# Altium schematic sheet Transformer.SchDoc
size A
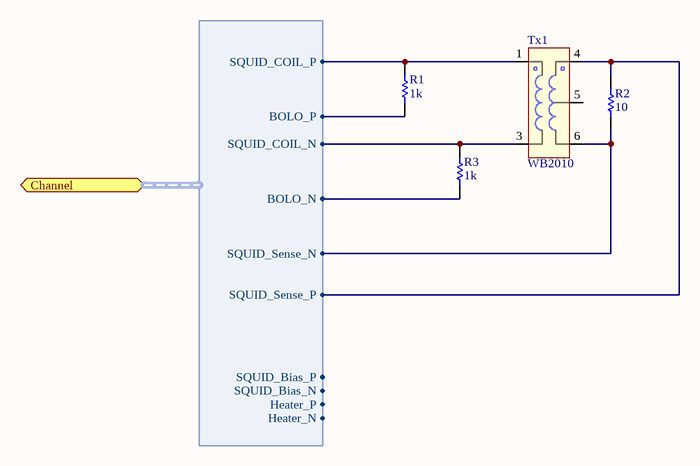
[diagram p0: Transformer.SchDoc]

## Parts
R1  value 1k  [0603]  (hidden comment: 10k)
R2  value 10  [0603]  (hidden comment: 10k)
R3  value 1k  [0603]  (hidden comment: 10k)
Tx1  WB2010  [WB2010]

## Ports
Channel (harness SQUID_CH_IN)

## Harnesses
SQUID_CH_IN: SQUID_COIL_P, SQUID_COIL_N, BOLO_P, BOLO_N, SQUID_Sense_P, SQUID_Bias_P, SQUID_Bias_N, Heater_P, SQUID_Sense_N, Heater_N

## Nets
NetR1_1: R1.1 ; port Channel.BOLO_P
NetR1_2: R1.2 Tx1.1 ; port Channel.SQUID_COIL_P
NetR2_1: R2.1 Tx1.6 ; port Channel.SQUID_Sense_N
NetR2_2: R2.2 Tx1.4 ; port Channel.SQUID_Sense_P
NetR3_1: R3.1 ; port Channel.BOLO_N
NetR3_2: R3.2 Tx1.3 ; port Channel.SQUID_COIL_N

Not connected (* = marked no-connect by the designer): Tx1 5

## Library data of the parts
R1-R3 = RES 0603: Resistor; Manufacturer: Generic; ManufacturerPartNumber 1: e.g CRCW0603 series; Tolerance: 1%; Power: 1/10W; TempCoef: 100ppm/C; Supplier 1: Arrow; Supplier 2: Digi-Key; Supplier Part Number 1: 4070372S9500174N6892; Supplier Part Number 2: 541-0.0GDKR-ND
Tx1 = WB2010: WB2010 1:1 Transformer